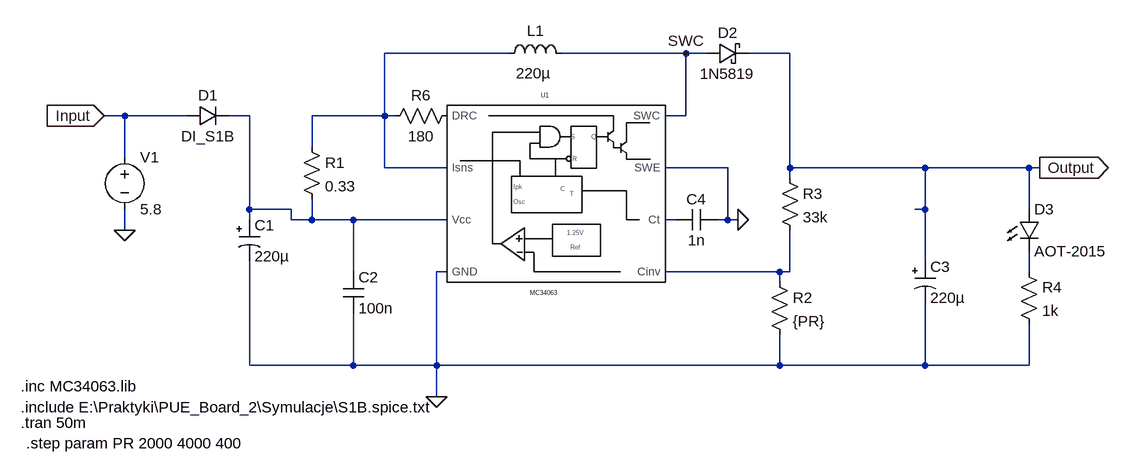
[diagram p0: schematic 6_Step_Up_PSU.asc]
6_Step_Up_PSU.asc, the LTspice schematic file:
Version 4
SHEET 1 1052 680
WIRE 96 -112 -96 -112
WIRE 368 -112 176 -112
WIRE 400 -112 368 -112
WIRE 528 -112 464 -112
WIRE -496 -16 -528 -16
WIRE -400 -16 -496 -16
WIRE -304 -16 -336 -16
WIRE -96 -16 -96 -112
WIRE -96 -16 -208 -16
WIRE -80 -16 -96 -16
WIRE 368 -16 368 -112
WIRE 368 -16 336 -16
WIRE -208 32 -208 -16
WIRE -496 48 -496 -16
WIRE -96 64 -96 -16
WIRE 0 64 -96 64
WIRE 432 64 336 64
WIRE 528 64 528 -112
WIRE 736 64 528 64
WIRE 896 64 736 64
WIRE 912 64 896 64
WIRE 528 80 528 64
WIRE -304 128 -304 -16
WIRE -240 128 -304 128
WIRE 736 128 736 64
WIRE 736 128 720 128
WIRE 896 128 896 64
WIRE -304 144 -304 128
WIRE -240 144 -240 128
WIRE -208 144 -208 112
WIRE -208 144 -240 144
WIRE -144 144 -208 144
WIRE 0 144 -144 144
WIRE 352 144 336 144
WIRE 432 144 432 64
WIRE 432 144 416 144
WIRE 448 144 432 144
WIRE -496 160 -496 128
WIRE 736 208 736 128
WIRE -144 224 -144 144
WIRE 0 224 -16 224
WIRE 512 224 336 224
WIRE 528 224 528 160
WIRE 528 224 512 224
WIRE 896 224 896 192
WIRE 512 240 512 224
WIRE -304 368 -304 208
WIRE -144 368 -144 288
WIRE -144 368 -304 368
WIRE -16 368 -16 224
WIRE -16 368 -144 368
WIRE 512 368 512 320
WIRE 512 368 -16 368
WIRE 736 368 736 272
WIRE 736 368 512 368
WIRE 896 368 896 304
WIRE 896 368 736 368
WIRE -16 416 -16 368
FLAG -16 416 0
FLAG -528 -16 Input
IOPIN -528 -16 In
FLAG 912 64 Output
IOPIN 912 64 Out
FLAG -496 160 0
FLAG 368 -112 SWC
FLAG 448 144 0
SYMBOL diode -400 0 R270
WINDOW 0 32 32 VTop 2
WINDOW 3 0 32 VBottom 2
SYMATTR InstName D1
SYMATTR Value DI_S1B
SYMBOL res -224 16 R0
SYMATTR InstName R1
SYMATTR Value 0.33
SYMATTR SpiceLine tol=1 pwr=1
SYMBOL polcap -320 144 R0
WINDOW 3 24 56 Left 2
SYMATTR Value 220µ
SYMATTR InstName C1
SYMATTR Description Capacitor
SYMATTR Type cap
SYMATTR SpiceLine V=25 Irms=575m Rser=0.12 Lser=0 mfg="Panasonic" pn="ECA1EFQ221L" type="Al electrolytic"
SYMBOL polcap 720 208 R0
WINDOW 3 24 56 Left 2
SYMATTR Value 220µ
SYMATTR InstName C3
SYMATTR Description Capacitor
SYMATTR Type cap
SYMATTR SpiceLine V=35 Irms=760m Rser=0.09 Lser=0 mfg="Panasonic" pn="ECA1VFQ221" type="Al electrolytic"
SYMBOL ind 80 -96 R270
WINDOW 0 35 57 VTop 2
WINDOW 3 1 53 VBottom 2
SYMATTR InstName L1
SYMATTR Value 220µ
SYMATTR SpiceLine Ipk=1 Rser=0.366 Rpar=89931.3 Cpar=7.74133p mfg="Wurth Elektronik" pn="7447714221 WE-PD 1050"
SYMBOL cap 416 128 R90
WINDOW 0 0 32 VBottom 2
WINDOW 3 32 32 VTop 2
SYMATTR InstName C4
SYMATTR Value 1n
SYMBOL schottky 400 -96 R270
WINDOW 0 32 32 VTop 2
WINDOW 3 0 32 VBottom 2
SYMATTR InstName D2
SYMATTR Value 1N5819
SYMATTR Description Diode
SYMATTR Type diode
SYMBOL voltage -496 32 R0
WINDOW 123 0 0 Left 2
WINDOW 39 0 0 Left 2
SYMATTR InstName V1
SYMATTR Value 5.8
SYMBOL mc34063 240 80 R0
SYMATTR InstName U1
SYMBOL res -96 0 R270
WINDOW 0 32 56 VTop 2
WINDOW 3 0 56 VBottom 2
SYMATTR InstName R6
SYMATTR Value 180
SYMATTR SpiceLine tol=1 pwr=1
SYMBOL res 496 224 R0
SYMATTR InstName R2
SYMATTR Value {PR}
SYMATTR SpiceLine tol=1
SYMBOL cap -160 224 R0
SYMATTR InstName C2
SYMATTR Value 100n
SYMBOL res 512 64 R0
SYMATTR InstName R3
SYMATTR Value 33k
SYMATTR SpiceLine tol=1
SYMBOL res 880 208 R0
SYMATTR InstName R4
SYMATTR Value 1k
SYMATTR SpiceLine tol=1
SYMBOL LED 880 128 R0
SYMATTR InstName D3
SYMATTR Value AOT-2015
SYMATTR Description Diode
SYMATTR Type diode
TEXT -656 432 Left 2 !.include E:\\Praktyki\\PUE_Board_2\\Symulacje\\S1B.spice.txt
TEXT -656 400 Left 2 !.inc MC34063.lib
TEXT -656 456 Left 2 !.tran 50m
TEXT -648 488 Left 2 !.step param PR 2000 4000 400

The netlist it stands for:
* 6_Step_Up_PSU.asc
D1 Input N002 DI_S1B
R1 N001 N002 0.33 tol=1 pwr=1
C1 N002 0 220µ V=25 Irms=575m Rser=0.12 Lser=0 mfg="Panasonic" pn="ECA1EFQ221L" type="Al electrolytic"
C3 Output 0 220µ V=35 Irms=760m Rser=0.09 Lser=0 mfg="Panasonic" pn="ECA1VFQ221" type="Al electrolytic"
L1 N001 SWC 220µ Ipk=1 Rser=0.366 Rpar=89931.3 Cpar=7.74133p mfg="Wurth Elektronik" pn="7447714221 WE-PD 1050"
C4 0 N003 1n
D2 SWC Output 1N5819
V1 Input 0 5.8
XU1 SWC 0 N003 0 N004 N002 N001 P001 MC34063  ; pins SWC SWE Ct GND Cinv Vcc Isns DRC
R6 N001 P001 180 tol=1 pwr=1
R2 N004 0 {PR} tol=1
C2 N002 0 100n
R3 Output N004 33k tol=1
R4 N005 0 1k tol=1
D3 Output N005 AOT-2015
.model D D
.lib standard.dio
.include E:\Praktyki\PUE_Board_2\Symulacje\S1B.spice.txt
.inc MC34063.lib
.tran 50m
.step param PR 2000 4000 400
.backanno
.end